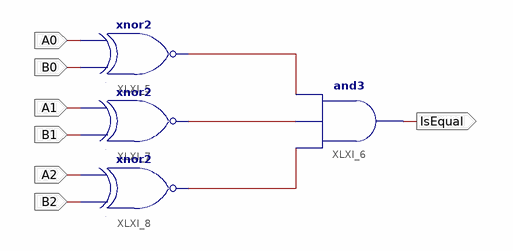
[diagram p0: schematic sheet 1]
// Xilinx ISE schematic Comparator.sch (spartan6) as structural Verilog: 4 symbols, 7 ports
module Comparator (
  input  A0,
  input  B0,
  input  A1,
  input  B1,
  input  A2,
  input  B2,
  output IsEqual
);

  wire XLXN_1, XLXN_12, XLXN_13;

  xnor XLXI_5 (XLXN_1, B0, A0);
  and XLXI_6 (IsEqual, XLXN_13, XLXN_12, XLXN_1);
  xnor XLXI_7 (XLXN_12, B1, A1);
  xnor XLXI_8 (XLXN_13, B2, A2);
endmodule
